# EasyEDA Pro project ProPrj_ArpiGlasses_Final2_2025-06-16.epro, board PCB_ArpiGlasses
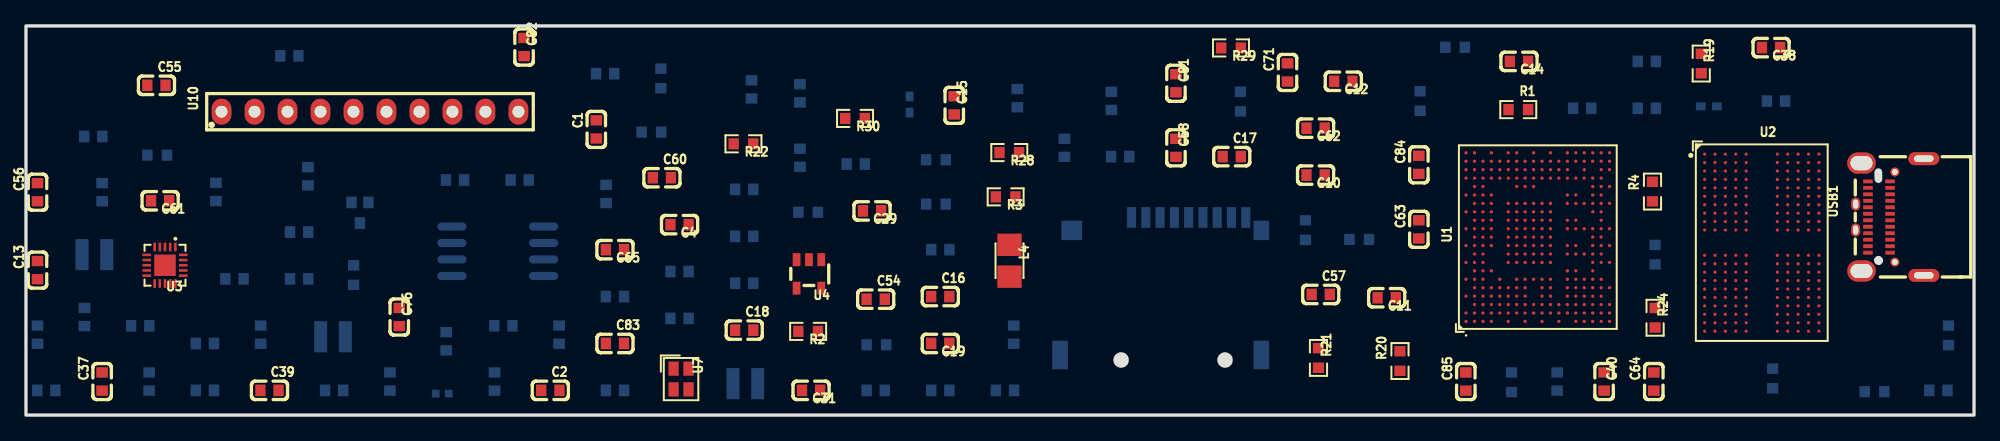
[diagram p1: board, top side]
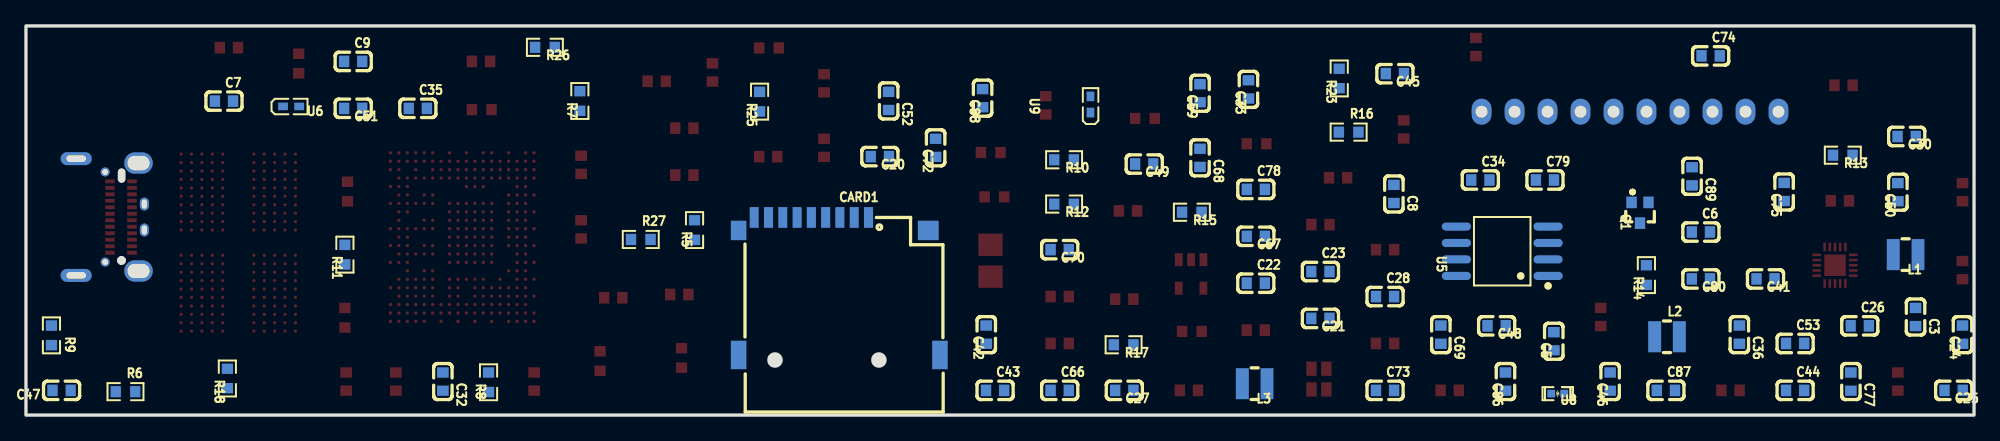
[diagram p2: board, bottom side, seen from below]

Outline 150 x 30 mm; copper layers: Top Layer, GND, Inner2, Inner3, Inner4, Bottom Layer. Coordinates in mm from the lower left corner of the outline.
Outline path: rectangle 0,30 150,0
Stack: Top Layer 0.035mm Outer layer thickness 1oz / Dielectric1 0.0994mm 3313 RC57% 4.2mil / GND 0.0152mm Inner layer thickness / Dielectric2 0.55mm 0.55mm H/H No copper / Inner2 0.0152mm Inner layer thickness / Dielectric3 0.1088mm 2116 RC54% 4.9mil / Inner3 0.0152mm Inner layer thickness / Dielectric4 0.55mm 0.55mm H/H No copper / Inner4 0.0152mm Inner layer thickness / Dielectric5 0.0994mm 3313 RC57% 4.2mil / Bottom Layer 0.035mm Outer layer thickness 1oz

## Design rules (mm)
template: User Custom Config
spacing Default (default): track to track 0.076, other pairs 0.076 to 0.076
track width Default (default): min 0.254, default 0.254, max 25.4
differential pair differentialPair (default): width min 0.127, default 0.254, max 2.54; gap min 0.152, default 0.152
via Default (default): diameter min 0.61, default 0.61, max 100.025; hole min 0.305, default 0.305, max 59.995

## Placement (name value [footprint] x y rotation side)
C1  2.2uf  [C0603]  43.92 22.02 90 top
C2  100nf  [C0603]  40.37 1.9 0 top
C3  22uf  [C0603]  4.5 7.56 270 bottom
C4  22uf  [C0603]  50.33 14.68 180 top
C5  22uf  [C0603]  32.36 5.69 90 bottom
C6  22uf  [C0603]  21.03 14.11 180 bottom
C7  22uf  [C0603]  134.75 24.2 180 bottom
C8  22uf  [C0603]  44.67 17.05 270 bottom
C9  22uf  [C0603]  124.8 27.27 180 bottom
C10  10uf  [C0603]  99.3 18.5 180 top
C11  220nf  [C0603]  104.78 9.05 180 top
C12  1uf  [C0603]  101.44 25.73 180 top
C13  100nf  [C0603]  0.89 11.17 90 top
C14  470nf  [C0603]  114.96 27.27 180 top
C15  1uf  [C0603]  71.48 23.88 270 top
C16  2.2uf  [C0603]  70.4 9.14 0 top
C17  470nf  [C0603]  92.84 19.92 0 top
C18  2.2uf  [C0603]  55.31 6.55 0 top
C19  2.2uf  [C0603]  70.4 5.52 180 top
C20  2.2uf  [C0603]  84.25 19.92 0 bottom
C21  2.2uf  [C0603]  50.33 7.45 0 bottom
C22  2.2uf  [C0603]  55.31 10.17 180 bottom
C23  2.2uf  [C0603]  50.33 11.07 180 bottom
C24  10uf  [C0603]  0.89 6.2 90 bottom
C25  2.2uf  [C0603]  1.57 1.9 0 bottom
C26  10uf  [C0603]  8.8 6.88 180 bottom
C27  100nf  [C0603]  65.43 1.9 0 bottom
C28  100nf  [C0603]  45.35 9.14 180 bottom
C29  100nf  [C0603]  65.15 15.74 180 top
C30  100nf  [C0603]  5.18 21.48 0 bottom
C31  12pf  [C0603]  60.45 1.9 180 top
C32  12pf  [C0603]  117.9 2.58 270 bottom
C33  1nf  [C0603]  55.87 25.11 90 bottom
C34  22uf  [C0603]  38.01 18.12 180 bottom
C35  2.2nf  [C0603]  119.83 23.65 180 bottom
C36  1uf  [C0603]  18.07 6.2 270 bottom
C37  1uf  [C0603]  5.86 2.58 90 top
C38  2.2nf  [C0603]  134.37 28.33 180 top
C39  2.2nf  [C0603]  18.75 1.9 0 top
C40  1uf  [C0603]  121.51 2.58 270 top
C41  100nf  [C0603]  16.06 10.5 0 bottom
C42  100nf  [C0603]  76.06 6.2 90 bottom
C43  100nf  [C0603]  75.38 1.9 180 bottom
C44  100nf  [C0603]  13.78 1.9 180 bottom
C45  1uf  [C0603]  44.59 26.32 0 bottom
C46  1uf  [C0603]  28.02 2.58 90 bottom
C47  1uf  [C0603]  147.26 1.9 180 bottom
C48  100nf  [C0603]  36.76 6.88 0 bottom
C49  100nf  [C0603]  63.89 19.35 0 bottom
C50  1uf  [C0603]  5.86 17.18 90 bottom
C51  1uf  [C0603]  124.8 23.65 0 bottom
C52  1uf  [C0603]  83.57 24.22 270 bottom
C53  100nf  [C0603]  13.78 5.52 180 bottom
C54  100nf  [C0603]  65.43 8.93 0 top
C55  100nf  [C0603]  10.05 25.42 0 top
C56  100nf  [C0603]  0.89 17.18 90 top
C57  1uf  [C0603]  99.69 9.3 0 top
C58  22uf  [C0603]  88.55 20.6 270 top
C59  4.7uf  [C0603]  59.6 24.81 90 bottom
C60  22uf  [C0603]  48.97 18.3 0 top
C61  1uf  [C0603]  10.33 16.52 180 top
C62  22uf  [C0603]  99.3 22.12 180 top
C63  22uf  [C0603]  107.25 14.32 90 top
C64  22uf  [C0603]  125.34 2.58 90 top
C65  1uf  [C0603]  45.35 12.75 180 top
C66  22uf  [C0603]  70.4 1.9 180 bottom
C67  22uf  [C0603]  55.3 13.78 0 bottom
C68  22uf  [C0603]  59.6 19.83 270 bottom
C69  22uf  [C0603]  41.05 6.2 270 bottom
C70  1uf  [C0603]  70.4 12.75 0 bottom
C71  1uf  [C0603]  97.14 26.41 90 top
C72  22uf  [C0603]  79.96 20.6 90 bottom
C73  22uf  [C0603]  45.35 1.9 180 bottom
C74  1nf  [C0603]  20.28 27.69 180 bottom
C75  100nf  [C0603]  14.63 17.2 90 bottom
C76  100nf  [C0603]  28.74 7.56 270 top
C77  22uf  [C0603]  9.48 2.58 270 bottom
C78  100nf  [C0603]  55.3 17.4 180 bottom
C79  12pf  [C0603]  33.04 18.12 180 bottom
C80  22uf  [C0603]  21.03 10.49 0 bottom
C81  10uf  [C0603]  88.55 25.58 270 top
C82  100nf  [C0603]  38.35 28.37 270 top
C83  100nf  [C0603]  45.35 5.52 0 top
C84  4.7uf  [C0603]  107.25 19.29 90 top
C85  100nf  [C0603]  110.87 2.58 90 top
C86  100nf  [C0603]  36.08 2.58 90 bottom
C87  4.7uf  [C0603]  23.73 1.9 180 bottom
C88  10uf  [C0603]  76.34 24.43 90 bottom
C89  100nf  [C0603]  21.71 18.41 270 bottom
CARD1  TF PUSH  [TF-SMD_TF-PUSH]  87.38 9.93 180 bottom
L1  1uH  [IND-SMD_L2.5-W2.0_AHP252010X]  5.27 12.37 0 bottom
L2  1uH  [IND-SMD_L2.5-W2.0_AHP252010X]  23.64 6.03 180 bottom
L3  1uH  [IND-SMD_L2.5-W2.0_AHP252010X]  55.39 2.42 0 bottom
L4  2.2uH  [IND-SMD_L2.5-W2.0_WPN252012H]  75.73 11.9 270 top
Q1  2SK3018W  [SOT-323_L2.0-W1.3-P1.30-LS2.1-TR]  25.72 15.6 90 bottom
R1  10  [R0603]  114.91 23.55 0 top
R2  10k  [R0603]  60.23 6.45 180 top
R3  10k  [R0603]  75.43 16.82 180 top
R4  10k  [R0603]  125.24 17.23 90 top
R5  150k  [R0603]  98.52 14.26 90 bottom
R6  10k  [R0603]  142.34 1.8 180 bottom
R7  20k  [R0603]  107.35 24.21 90 bottom
R8  6.04k  [R0603]  114.38 2.53 90 bottom
R9  10  [R0603]  148.04 6.14 270 bottom
R10  10k  [R0603]  70.06 19.68 0 bottom
R11  0  [R0603]  125.44 12.37 90 bottom
R12  100  [R0603]  70.06 16.27 0 bottom
R13  240  [R0603]  10.1 20.03 0 bottom
R14  510  [R0603]  25.23 10.79 90 bottom
R15  10k  [R0603]  60.23 15.64 0 bottom
R16  232k  [R0603]  48.16 21.81 180 bottom
R17  49.9k  [R0603]  65.48 5.42 0 bottom
R18  240  [R0603]  134.49 2.82 90 bottom
R19  240  [R0603]  129 27.1 270 top
R20  100k  [R0603]  105.8 4.17 90 top
R21  100k  [R0603]  99.52 4.4 270 top
R22  100k  [R0603]  55.25 20.91 180 top
R23  100k  [R0603]  48.88 25.95 90 bottom
R24  100k  [R0603]  125.44 7.5 270 top
R25  10k  [R0603]  93.51 24.16 90 bottom
R26  10k  [R0603]  110.04 28.35 0 bottom
R27  5.1k  [R0603]  102.66 13.54 180 bottom
R28  5.1k  [R0603]  75.72 20.24 180 top
R29  5.1k  [R0603]  92.79 28.3 180 top
R30  1.8k  [R0603]  63.84 22.87 180 top
U1  H616_C5365289  [BGA-284_L14.0-W12.0-P0.65-TL]  116.41 13.72 90 top
U2  K4F8E304HB-MGCJ  [BGA-200_L15.0-W10.0_K4F8E304HB-MGCJ]  133.66 13.29 0 top
U3  AXP313A_C5365290  [QFN-20_L3.0-W3.0-P0.40-BL-EP1.7]  10.71 11.55 180 top
U4  SY8089AAC  [SOT-23-5_L2.9-W1.6-P0.95-LS2.8-BL]  60.29 10.88 180 top
U5  W25Q128JWSIQ  [SOIC-8_L5.3-W5.3-P1.27-LS8.0-BL]  36.33 12.63 90 bottom
U6  SML-P12U2TT86R  [LED0402-R-RD]  129.58 23.8 180 bottom
U7  24MHz  [CRYSTAL-SMD_4P-L2.0-W1.6-BL-2]  50.44 2.78 270 top
U8  ESD0402  [D0402-BI]  32.05 1.65 0 bottom
U9  SML-P12U2TT86R  [LED0402-R-RD]  68.04 23.95 90 bottom
U10  MPU  [PIN HEADER 1X10PIN 2.54MM 10P]  15.06 23.39 90 top
USB1  UT12113-11601-7H  [USB-C-SMD_UT12113-11601-7H]  143.51 15.27 90 top

## Footprints (pads in the part's own frame, mm; a bottom-side part is the same pattern mirrored in y, then rotated)
BGA-200_L15.0-W10.0_K4F8E304HB-MGCJ
  round 0.248 smd: A1(-4.4,6.825) A2(-3.6,6.825) A3(-2.8,6.825) A4(-2,6.825) A5(-1.2,6.825) A8(1.2,6.825) A9(2,6.825) A10(2.8,6.825) A11(3.6,6.825) A12(4.4,6.825) AA1(-4.4,-6.175) AA2(-3.6,-6.175) AA3(-2.8,-6.175) AA4(-2,-6.175) AA5(-1.2,-6.175) AA8(1.2,-6.175) AA9(2,-6.175) AA10(2.8,-6.175) AA11(3.6,-6.175) AA12(4.4,-6.175) AB1(-4.4,-6.825) AB2(-3.6,-6.825) AB3(-2.8,-6.825) AB4(-2,-6.825) AB5(-1.2,-6.825) AB8(1.2,-6.825) AB9(2,-6.825) AB10(2.8,-6.825) AB11(3.6,-6.825) AB12(4.4,-6.825) B1(-4.4,6.175) B2(-3.6,6.175) B3(-2.8,6.175) B4(-2,6.175) B5(-1.2,6.175) B8(1.2,6.175) B9(2,6.175) B10(2.8,6.175) B11(3.6,6.175) B12(4.4,6.175) C1(-4.4,5.525) C2(-3.6,5.525) C3(-2.8,5.525) C4(-2,5.525) C5(-1.2,5.525) C8(1.2,5.525) C9(2,5.525) C10(2.8,5.525) C11(3.6,5.525) C12(4.4,5.525) D1(-4.4,4.875) D2(-3.6,4.875) D3(-2.8,4.875) D4(-2,4.875) D5(-1.2,4.875) D8(1.2,4.875) D9(2,4.875) D10(2.8,4.875) D11(3.6,4.875) D12(4.4,4.875) E1(-4.4,4.225) E2(-3.6,4.225) E3(-2.8,4.225) E4(-2,4.225) E5(-1.2,4.225) E8(1.2,4.225) E9(2,4.225) E10(2.8,4.225) E11(3.6,4.225) E12(4.4,4.225) F1(-4.4,3.575) F2(-3.6,3.575) F3(-2.8,3.575) F4(-2,3.575) F5(-1.2,3.575) F8(1.2,3.575) F9(2,3.575) F10(2.8,3.575) F11(3.6,3.575) F12(4.4,3.575) G1(-4.4,2.925) G2(-3.6,2.925) G3(-2.8,2.925) G4(-2,2.925) G5(-1.2,2.925) G8(1.2,2.925) G9(2,2.925) G10(2.8,2.925) G11(3.6,2.925) G12(4.4,2.925) H1(-4.4,2.275) H2(-3.6,2.275) H3(-2.8,2.275) H4(-2,2.275) H5(-1.2,2.275) H8(1.2,2.275) H9(2,2.275) H10(2.8,2.275) H11(3.6,2.275) H12(4.4,2.275) J1(-4.4,1.625) J2(-3.6,1.625) J3(-2.8,1.625) J4(-2,1.625) J5(-1.2,1.625) J8(1.2,1.625) J9(2,1.625) J10(2.8,1.625) J11(3.6,1.625) J12(4.4,1.625) K1(-4.4,0.975) K2(-3.6,0.975) K3(-2.8,0.975) K4(-2,0.975) K5(-1.2,0.975) K8(1.2,0.975) K9(2,0.975) K10(2.8,0.975) K11(3.6,0.975) K12(4.4,0.975) N1(-4.4,-0.975) N2(-3.6,-0.975) N3(-2.8,-0.975) N4(-2,-0.975) N5(-1.2,-0.975) N8(1.2,-0.975) N9(2,-0.975) N10(2.8,-0.975) N11(3.6,-0.975) N12(4.4,-0.975) P1(-4.4,-1.625) P2(-3.6,-1.625) P3(-2.8,-1.625) P4(-2,-1.625) P5(-1.2,-1.625) P8(1.2,-1.625) P9(2,-1.625) P10(2.8,-1.625) P11(3.6,-1.625) P12(4.4,-1.625) R1(-4.4,-2.275) R2(-3.6,-2.275) R3(-2.8,-2.275) R4(-2,-2.275) R5(-1.2,-2.275) R8(1.2,-2.275) R9(2,-2.275) R10(2.8,-2.275) R11(3.6,-2.275) R12(4.4,-2.275) T1(-4.4,-2.925) T2(-3.6,-2.925) T3(-2.8,-2.925) T4(-2,-2.925) T5(-1.2,-2.925) T8(1.2,-2.925) T9(2,-2.925) T10(2.8,-2.925) T11(3.6,-2.925) T12(4.4,-2.925) U1(-4.4,-3.575) U2(-3.6,-3.575) U3(-2.8,-3.575) U4(-2,-3.575) U5(-1.2,-3.575) U8(1.2,-3.575) U9(2,-3.575) U10(2.8,-3.575) U11(3.6,-3.575) U12(4.4,-3.575) V1(-4.4,-4.225) V2(-3.6,-4.225) V3(-2.8,-4.225) V4(-2,-4.225) V5(-1.2,-4.225) V8(1.2,-4.225) V9(2,-4.225) V10(2.8,-4.225) V11(3.6,-4.225) V12(4.4,-4.225) W1(-4.4,-4.875) W2(-3.6,-4.875) W3(-2.8,-4.875) W4(-2,-4.875) W5(-1.2,-4.875) W8(1.2,-4.875) W9(2,-4.875) W10(2.8,-4.875) W11(3.6,-4.875) W12(4.4,-4.875) Y1(-4.4,-5.525) Y2(-3.6,-5.525) Y3(-2.8,-5.525) Y4(-2,-5.525) Y5(-1.2,-5.525) Y8(1.2,-5.525) Y9(2,-5.525) Y10(2.8,-5.525) Y11(3.6,-5.525) Y12(4.4,-5.525)
BGA-284_L14.0-W12.0-P0.65-TL
  round 0.256 smd: A1(-6.5,5.525) A2(-5.85,5.525) A4(-4.55,5.525) A6(-3.25,5.525) A8(-1.95,5.525) A10(-0.65,5.525) A12(0.65,5.525) A14(1.95,5.525) A16(3.25,5.525) A18(4.55,5.525) A19(5.2,5.525) A20(5.849,5.525) A21(6.5,5.525) B1(-6.5,4.875) B2(-5.85,4.875) B3(-5.2,4.875) B4(-4.55,4.875) B5(-3.9,4.875) B6(-3.25,4.875) B7(-2.6,4.875) B8(-1.95,4.875) B9(-1.3,4.875) B10(-0.65,4.875) B11(0,4.875) B12(0.65,4.875) B13(1.3,4.875) B14(1.95,4.875) B15(2.6,4.875) B16(3.25,4.875) B17(3.9,4.875) B18(4.55,4.875) B19(5.2,4.875) B20(5.849,4.875) B21(6.5,4.875) C1(-6.5,4.225) C2(-5.85,4.225) C3(-5.2,4.225) C4(-4.55,4.225) C5(-3.9,4.225) C6(-3.25,4.225) C7(-2.6,4.225) C8(-1.95,4.225) C9(-1.3,4.225) C10(-0.65,4.225) C11(0,4.225) C12(0.65,4.225) C13(1.3,4.225) C14(1.95,4.225) C15(2.6,4.225) C16(3.25,4.225) C17(3.9,4.225) C18(4.55,4.225) C19(5.2,4.225) C20(5.849,4.225) D1(-6.5,3.575) D2(-5.85,3.575) D3(-5.2,3.575) D4(-4.55,3.575) D5(-3.9,3.575) D7(-2.6,3.575) D10(-0.65,3.575) D11(0,3.575) D12(0.65,3.575) D13(1.3,3.575) D14(1.95,3.575) D15(2.6,3.575) D16(3.25,3.575) D18(4.55,3.575) D19(5.2,3.575) D20(5.849,3.575) D21(6.5,3.575) E2(-5.85,2.925) E3(-5.2,2.925) E4(-4.55,2.925) E5(-3.9,2.925) E6(-3.25,2.925) E18(4.55,2.925) E19(5.2,2.925) E20(5.849,2.925) F1(-6.5,2.275) F2(-5.85,2.275) F3(-5.2,2.275) F4(-4.55,2.275) F5(-3.9,2.275) F8(-1.95,2.275) F9(-1.3,2.275) F10(-0.65,2.275) F11(0,2.275) F12(0.65,2.275) F13(1.3,2.275) F14(1.95,2.275) F15(2.6,2.275) F18(4.55,2.275) F19(5.2,2.275) F20(5.849,2.275) F21(6.5,2.275) G2(-5.85,1.625) G3(-5.2,1.625) G4(-4.55,1.625) G5(-3.9,1.625) G6(-3.25,1.625) G8(-1.95,1.625) G9(-1.3,1.625) G10(-0.65,1.625) G11(0,1.625) G12(0.65,1.625) G13(1.3,1.625) G14(1.95,1.625) G15(2.6,1.625) G17(3.9,1.625) G18(4.55,1.625) G19(5.2,1.625) G20(5.849,1.625) G21(6.5,1.625) H1(-6.5,0.975) H2(-5.85,0.975) H3(-5.2,0.975) H4(-4.55,0.975) H5(-3.9,0.975) H6(-3.25,0.975) H8(-1.95,0.975) H9(-1.3,0.975) H10(-0.65,0.975) H11(0,0.975) H12(0.65,0.975) H13(1.3,0.975) H14(1.95,0.975) H15(2.6,0.975) H17(3.9,0.975) H18(4.55,0.975) H19(5.2,0.975) H20(5.849,0.975) J2(-5.85,0.325) J3(-5.2,0.325) J6(-3.25,0.325) J8(-1.95,0.325) J9(-1.3,0.325) J10(-0.65,0.325) J11(0,0.325) J12(0.65,0.325) J13(1.3,0.325) J14(1.95,0.325) J15(2.6,0.325) J17(3.9,0.325) J18(4.55,0.325) J19(5.2,0.325) J20(5.849,0.325) J21(6.5,0.325) K1(-6.5,-0.325) K2(-5.85,-0.325) K3(-5.2,-0.325) K4(-4.55,-0.325) K5(-3.9,-0.325) K6(-3.25,-0.325) K8(-1.95,-0.325) K9(-1.3,-0.325) K10(-0.65,-0.325) K11(0,-0.325) K12(0.65,-0.325) K13(1.3,-0.325) K14(1.95,-0.325) K15(2.6,-0.325) K18(4.55,-0.325) K19(5.2,-0.325) K20(5.849,-0.325) L2(-5.85,-0.975) L3(-5.2,-0.975) L4(-4.55,-0.975) L5(-3.9,-0.975) L6(-3.25,-0.975) L8(-1.95,-0.975) L9(-1.3,-0.975) L10(-0.65,-0.975) L11(0,-0.975) L12(0.65,-0.975) L13(1.3,-0.975) L14(1.95,-0.975) L15(2.6,-0.975) L18(4.55,-0.975) L19(5.2,-0.975) L20(5.849,-0.975) L21(6.5,-0.975) M1(-6.5,-1.625) M2(-5.85,-1.625) M3(-5.2,-1.625) M18(4.55,-1.625) M19(5.2,-1.625) M20(5.849,-1.625) N2(-5.85,-2.275) N3(-5.2,-2.275) N4(-4.55,-2.275) N5(-3.9,-2.275) N6(-3.25,-2.275) N7(-2.6,-2.275) N9(-1.3,-2.275) N10(-0.65,-2.275) N12(0.65,-2.275) N13(1.3,-2.275) N15(2.6,-2.275) N16(3.25,-2.275) N18(4.55,-2.275) N19(5.2,-2.275) N20(5.849,-2.275) N21(6.5,-2.275) P1(-6.5,-2.925) P2(-5.85,-2.925) P3(-5.2,-2.925) P4(-4.55,-2.925) P5(-3.9,-2.925) P6(-3.25,-2.925) P7(-2.6,-2.925) P9(-1.3,-2.925) P10(-0.65,-2.925) P12(0.65,-2.925) P13(1.3,-2.925) P15(2.6,-2.925) P16(3.25,-2.925) P18(4.55,-2.925) P20(5.849,-2.925) P21(6.5,-2.925) R1(-6.5,-3.575) R2(-5.85,-3.575) R3(-5.2,-3.575) R4(-4.55,-3.575) R5(-3.9,-3.575) R6(-3.25,-3.575) R9(-1.3,-3.575) R12(0.65,-3.575) R15(2.6,-3.575) R18(4.55,-3.575) R19(5.2,-3.575) R20(5.849,-3.575) R21(6.5,-3.575) T1(-6.5,-4.225) T2(-5.85,-4.225) T3(-5.2,-4.225) T4(-4.55,-4.225) T5(-3.9,-4.225) T6(-3.25,-4.225) T7(-2.6,-4.225) T8(-1.95,-4.225) T9(-1.3,-4.225) T10(-0.65,-4.225) T11(0,-4.225) T12(0.65,-4.225) T14(1.95,-4.225) T15(2.6,-4.225) T16(3.25,-4.225) T17(3.9,-4.225) T18(4.55,-4.225) T20(5.849,-4.225) T21(6.5,-4.225) U1(-6.5,-4.875) U2(-5.85,-4.875) U3(-5.2,-4.875) U4(-4.55,-4.875) U5(-3.9,-4.875) U6(-3.25,-4.875) U8(-1.95,-4.875) U9(-1.3,-4.875) U10(-0.65,-4.875) U11(0,-4.875) U12(0.65,-4.875) U13(1.3,-4.875) U14(1.95,-4.875) U15(2.6,-4.875) U16(3.25,-4.875) U17(3.9,-4.875) U18(4.55,-4.875) U19(5.2,-4.875) U20(5.849,-4.875) U21(6.5,-4.875) V1(-6.5,-5.525) V2(-5.85,-5.525) V3(-5.2,-5.525) V5(-3.9,-5.525) V8(-1.95,-5.525) V10(-0.65,-5.525) V12(0.65,-5.525) V15(2.6,-5.525) V17(3.9,-5.525) V19(5.2,-5.525) V20(5.849,-5.525) V21(6.5,-5.525)
C0603
  rect 0.8x0.9 smd: 1(-0.7,0) 2(0.7,0)
CRYSTAL-SMD_4P-L2.0-W1.6-BL-2
  rect 1.1x0.8 smd: 1(-0.8,-0.575) 2(0.8,-0.575) 3(0.8,0.575) 4(-0.8,0.575)
D0402-BI
  rect 0.6x0.6 smd: 1(-0.5,0) 2(0.5,0)
IND-SMD_L2.5-W2.0_AHP252010X
  rect 1x2.4 smd: 1(-0.95,0) 2(0.95,0)
IND-SMD_L2.5-W2.0_WPN252012H
  rect 1.724x1.87 smd: 1(1.228,0) 2(-1.228,0)
LED0402-R-RD
  rect 0.75x0.6 smd: 1(0.623,0) 2(-0.623,0)
PIN HEADER 1X10PIN 2.54MM 10P
  oval 2x1.524 hole 0.914: 1(0,0) 2(0,-2.54) 3(0,-5.08) 4(0,-7.62) 5(0,-10.16) 6(0,-12.7) 7(0,-15.24) 8(0,-17.78) 9(0,-20.32) 10(0,-22.86)
QFN-20_L3.0-W3.0-P0.40-BL-EP1.7
  rect 0.2x0.665 smd: 1(-0.8,-1.407) 2(-0.4,-1.407) 3(0,-1.407) 4(0.4,-1.407) 5(0.8,-1.407) 11(0.8,1.407) 12(0.4,1.407) 13(0,1.407) 14(-0.4,1.407) 15(-0.8,1.407)
  rect 0.665x0.2 smd: 6(1.407,-0.8) 7(1.407,-0.4) 8(1.407,0) 9(1.407,0.4) 10(1.407,0.8) 16(-1.407,0.8) 17(-1.407,0.4) 18(-1.407,0) 19(-1.407,-0.4) 20(-1.407,-0.8)
  rect 1.65x1.65 smd: 21(0,0)
R0603
  rect 0.806x0.864 smd: 1(-0.753,0) 2(0.753,0)
SOIC-8_L5.3-W5.3-P1.27-LS8.0-BL
  oval 0.63x2.25 smd: 1(-1.905,-3.53) 2(-0.635,-3.53) 3(0.635,-3.53) 4(1.905,-3.53) 5(1.905,3.53) 6(0.635,3.53) 7(-0.635,3.53) 8(-1.905,3.53)
SOT-23-5_L2.9-W1.6-P0.95-LS2.8-BL
  rect 0.6x1 smd: 1(-0.95,-1.1) 2(0,-1.1) 3(0.95,-1.1) 4(0.95,1.1) 5(-0.95,1.1)
SOT-323_L2.0-W1.3-P1.30-LS2.1-TR
  rect 0.9x0.8 smd: 1(0.8,0.65) 2(0.8,-0.65) 3(-0.8,0)
TF-SMD_TF-PUSH
  rect 0.7x1.6 smd: 1(2.25,5.3) 2(1.15,5.3) 3(0.05,5.3) 4(-1.05,5.3) 5(-2.15,5.3) 6(-3.25,5.3) 7(-4.35,5.3) 8(-5.45,5.3) CD(-6.55,5.3)
  rect 1.2x1.5 smd: 10(-7.75,4.3)
  rect 1.2x2.2 smd: 11(-7.75,-5.3) 12(7.75,-5.3)
  rect 1.6x1.5 smd: 13(6.85,4.3)
USB-C-SMD_UT12113-11601-7H
  round 0.7 hole 0.45: 1(-3.475,-0.395) 1(3.475,-0.395)
  oval 1x2.4 hole 0.5x1.5: 2(-4.5,-2.625) 2(4.5,-2.625)
  oval 1x0.7 hole 0.7x0.4: 2(-1,2.625) 2(1,2.625)
  oval 1.65x2.2 hole 1.1x1.7: 13(-4.16,2.176) 13(4.16,2.176)
  rect 0.3x0.74 smd: A1(-2.75,1.675) A2(-2.25,1.675) A3(-1.75,1.675) A4(-1.25,1.675) A5(-0.75,1.675) A6(-0.25,1.675) A7(0.25,1.675) A8(0.75,1.675) A9(1.25,1.675) A10(1.75,1.675) A11(2.25,1.675) A12(2.75,1.675) B1(2.75,-0.025) B2(2.251,-0.025) B3(1.75,-0.025) B4(1.25,-0.025) B5(0.75,-0.025) B6(0.251,-0.025) B7(-0.25,-0.025) B8(-0.75,-0.025) B9(-1.25,-0.025) B10(-1.75,-0.025) B11(-2.25,-0.025) B12(-2.749,-0.025)

## Nets
As in the schematic, except:
VCC-5V: C60.2 C66.1 C67.1 C76.2 C77.2 C79.1 C86.2 C87.2 C88.2 C89.2 R15.2 R16.1 R17.2 U3.2 U3.17 U3.20 U4.4 U4.5 U8.1 USB1.A4 USB1.A9 USB1.B4 USB1.B9
VCC-PC: C1.1 C2.2 C3.2 C13.1 C16.1 C28.2 C29.2 C62.2 U1.D10 U1.E18 U1.F5 U1.J6 U1.M18 U3.12
VCC-PG: C24.2 C25.2 C26.1 C27.2 C30.2 C40.2 C41.2 C56.2 C57.2 C58.2 C63.2 R7.2 R10.2 U1.D7 U1.D11 U1.D12 U1.F18 U1.H17 U1.H20 U1.L14 U2.F1 U2.F12 U2.G4 U2.G9 U2.T4 U2.T9 U2.U1 U2.U12 U3.15
DCDCE: C15.2 C79.2 C80.2 C81.1 C84.2 C85.2 CARD1.4 L4.1 R2.2 R3.2 R4.2 R16.2 R22.2 R23.2 R24.2 R25.2 R26.2 R29.1 U5.3 U5.7 U5.8 U10.1

Pads without a net: U1 B17 B18 C11 C16 C18 D14 N13 N16 N19 N20 N21 P16 P18 P20 P21 R15 R19 T20 U15 U16 U18 U19 U20 V20; U2 A1 A2 A11 A12 AA1 AA12 AB1 AB2 AB11 AB12 B1 B12 G11 K5 K8 N5 N8; U3 10; USB1 13 A2 A3 A8 A10 A11 B2 B3 B8 B10 B11
